# Altium schematic sheet mcu.SchDoc
size A4; SheetNumber: 8; SheetTotal: 9
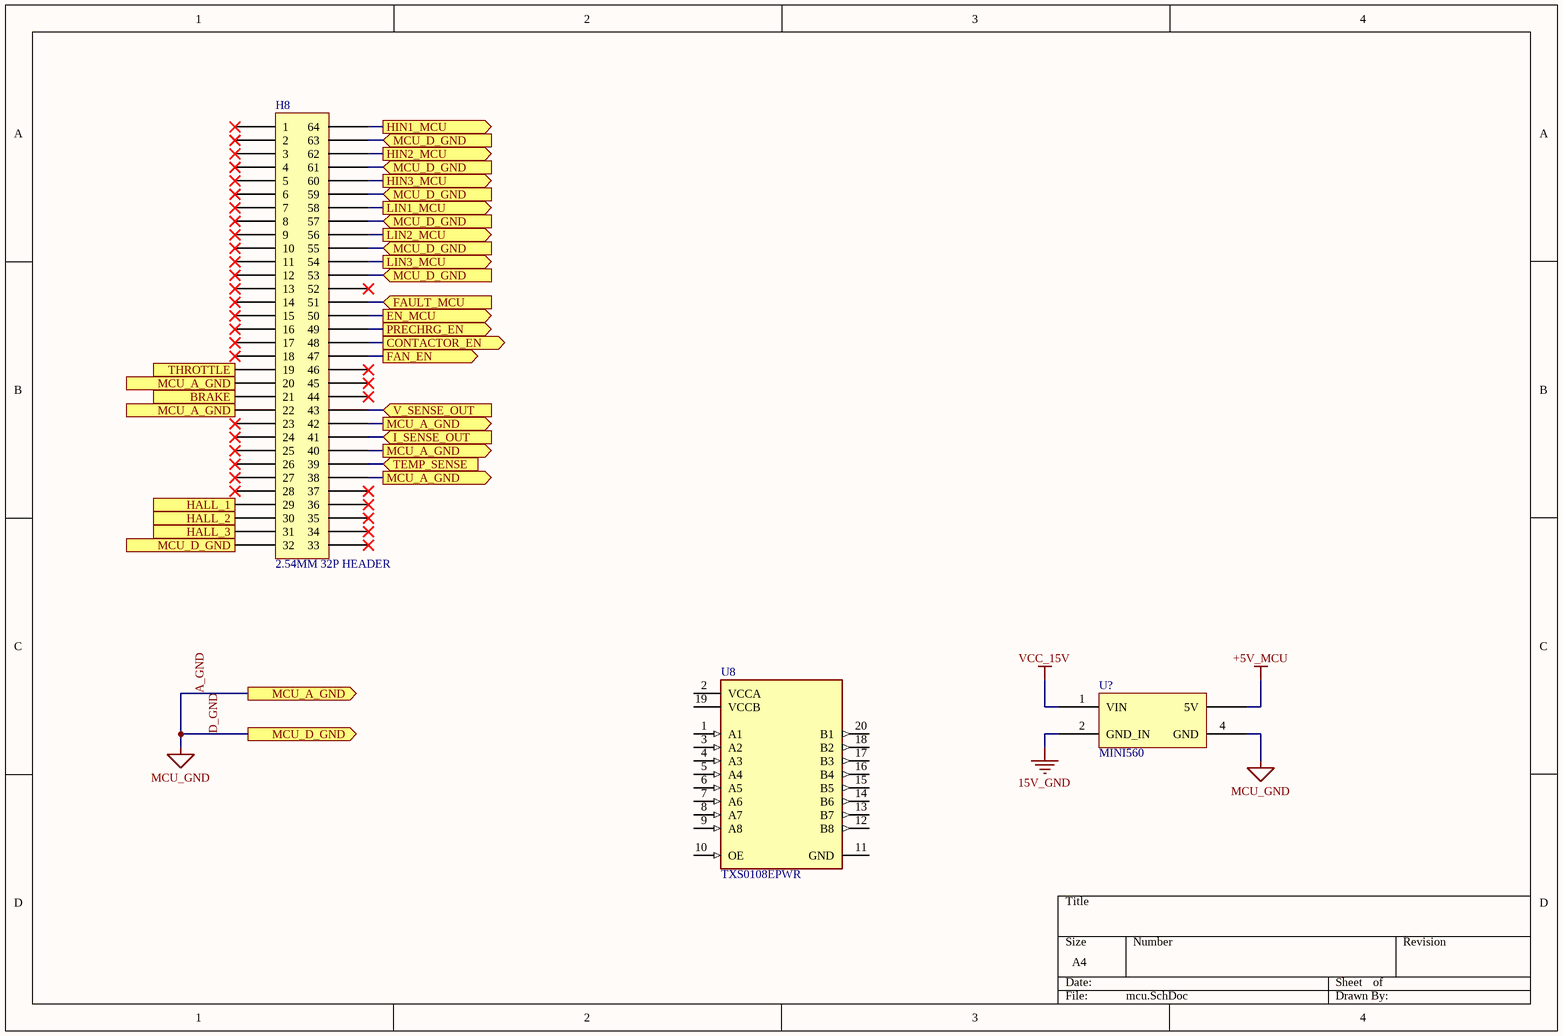
[diagram p0: mcu.SchDoc]

## Parts
H8  2.54MM 32P HEADER  [2.5mm 32p header]
U8  TXS0108EPWR  [FP-PW0020A-IPC_C]
U?  MINI560  [MINI560]

## Ports
BRAKE (in), CONTACTOR_EN (out), EN_MCU (out), FAN_EN (out), FAULT_MCU (in), HALL_1 (in), HALL_2 (in), HALL_3 (in), HIN1_MCU (out), HIN2_MCU (out), HIN3_MCU (out), I_SENSE_OUT (in), LIN1_MCU (out), LIN2_MCU (out), LIN3_MCU (out), MCU_A_GND (out), MCU_D_GND (in), MCU_D_GND (out), PRECHRG_EN (out), TEMP_SENSE (in), THROTTLE (in), V_SENSE_OUT (in)

## Nets
15V_GND: U?.2(GND_IN)
+5V_MCU: U?.3(5V)
A_GND: H8.20 H8.22 H8.32 H8.38 H8.40 H8.42 H8.53 H8.55 H8.57 H8.59 H8.61 H8.63 U?.4(GND) ; port MCU_D_GND, port MCU_A_GND  [also labelled D_GND, MCU_GND]
VCC_15V: U?.1(VIN)
BRAKE: H8.21 ; port BRAKE
CONTACTOR_EN: H8.48 ; port CONTACTOR_EN
EN_MCU: H8.50 ; port EN_MCU
FAN_EN: H8.47 ; port FAN_EN
FAULT_MCU: H8.51 ; port FAULT_MCU
HALL_1: H8.29 ; port HALL_1
HALL_2: H8.30 ; port HALL_2
HALL_3: H8.31 ; port HALL_3
HIN1_MCU: H8.64 ; port HIN1_MCU
HIN2_MCU: H8.62 ; port HIN2_MCU
HIN3_MCU: H8.60 ; port HIN3_MCU
I_SENSE_OUT: H8.41 ; port I_SENSE_OUT
LIN1_MCU: H8.58 ; port LIN1_MCU
LIN2_MCU: H8.56 ; port LIN2_MCU
LIN3_MCU: H8.54 ; port LIN3_MCU
PRECHRG_EN: H8.49 ; port PRECHRG_EN
TEMP_SENSE: H8.39 ; port TEMP_SENSE
THROTTLE: H8.19 ; port THROTTLE
V_SENSE_OUT: H8.43 ; port V_SENSE_OUT

Not connected (* = marked no-connect by the designer): H8 1* 2* 3* 4* 5* 6* 7* 8* 9* 10* 11* 12* 13* 14* 15* 16* 17* 18* 23* 24* 25* 26* 27* 28* 33* 34* 35* 36* 37* 44* 45* 46* 52*; U8 1(A1) 2(VCCA) 3(A2) 4(A3) 5(A4) 6(A5) 7(A6) 8(A7) 9(A8) 10(OE) 11(GND) 12(B8) 13(B7) 14(B6) 15(B5) 16(B4) 17(B3) 18(B2) 19(VCCB) 20(B1)

## Library data of the parts
H8 = 2.54MM 32P HEADER: 2×40 Pin Straight Female Berg Strip- 2.54mm Pitch; Price per piece: 13; Product URL: https://sharvielectronics.com/product/2x40-pin-straight-female-berg-strip-2-54mm-pitch/; Datasheet: https://sharvielectronics.com/wp-content/uploads/2020/02/Pin-Straight-Female-Berg-Strip-2.54mm-Pitch.pdf
U8 = CMP-2000-04956-2: IC TRNSLTR BIDIRECTIONAL 20TSSOP; Number of Inputs: 8; Supply Current: 8uA; Low Level Output Current: 50mA; Min Supply Voltage: 1.2V; Quiescent Current: 3uA; Output Type: Voltage; Propagation Delay: 4.8ns; Max Supply Voltage: 5.5V; Output Current: 620uA; Turn-On Delay Time: 312ns; Logic Function: Translator; Data Rate: 60Mbps; Rise Time: 6.3ns; High Level Output Current: -50mA; Number of Pins: 20; Packaging: Tape and Reel; Max Operating Temperature: 85°C; Height: 1.15mm; Nominal Supply Current: 8uA; Termination: SMD/SMT; Lead Free: Lead Free; Package Quantity: 1; Number of Bits: 8; Weight: 0.002716oz; Contact Plating: Gold; Series: -; Width: 4.4mm; Radiation Hardening: No; Mount: Surface Mount; Length: 6.5mm; Case/Package: TSSOP; REACH SVHC: No SVHC; RoHS Compliant: Yes; Min Operating Temperature: -40°C; Number of Channels: 8
U? = MINI560: MINI560 5VDC 5A Step-Down Stabilized Module; Price per piece: 125.33; Product URL: https://sharvielectronics.com/product/mini560-5vdc-5a-step-down-stabilized-module/